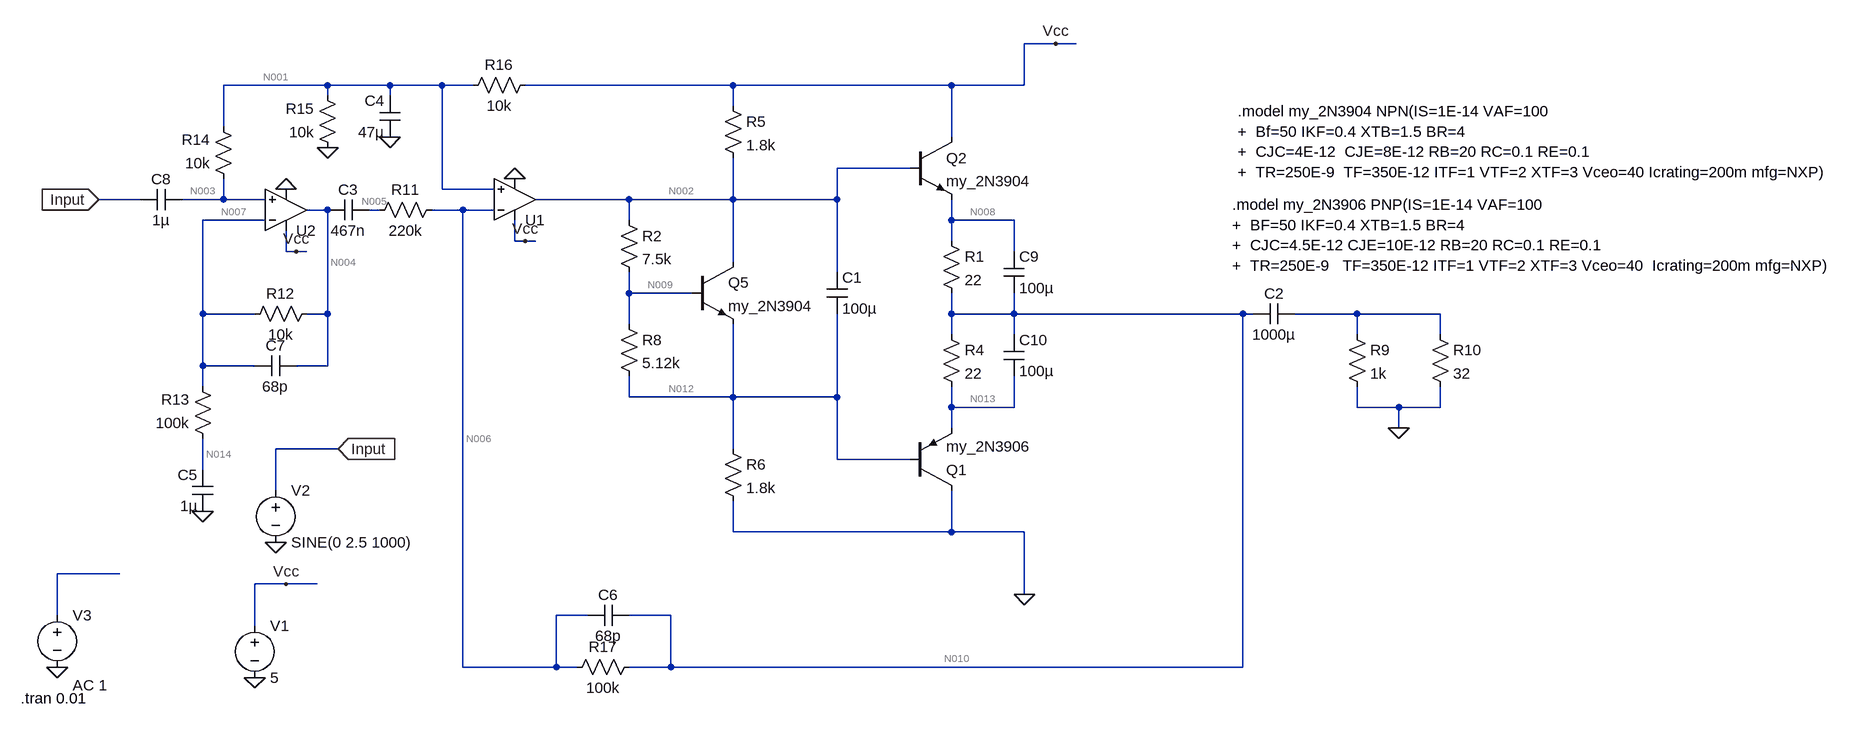
[diagram p0: schematic ECE421FinalProjectV2.asc]
ECE421FinalProjectV2.asc, the LTspice schematic file:
Version 4
SHEET 1 1656 692
WIRE 48 -336 0 -336
WIRE 80 -336 48 -336
WIRE -1072 -272 -1232 -272
WIRE -976 -272 -1072 -272
WIRE -896 -272 -976 -272
WIRE -848 -272 -896 -272
WIRE -448 -272 -768 -272
WIRE -112 -272 -448 -272
WIRE 0 -272 0 -336
WIRE 0 -272 -112 -272
WIRE -1072 -256 -1072 -272
WIRE -976 -256 -976 -272
WIRE -448 -240 -448 -272
WIRE -1232 -208 -1232 -272
WIRE -112 -192 -112 -272
WIRE -176 -144 -288 -144
WIRE -896 -112 -896 -272
WIRE -816 -112 -896 -112
WIRE -1360 -96 -1424 -96
WIRE -1232 -96 -1232 -128
WIRE -1232 -96 -1296 -96
WIRE -1168 -96 -1232 -96
WIRE -608 -96 -752 -96
WIRE -448 -96 -448 -160
WIRE -448 -96 -608 -96
WIRE -288 -96 -288 -144
WIRE -288 -96 -448 -96
WIRE -1072 -80 -1104 -80
WIRE -992 -80 -1008 -80
WIRE -864 -80 -912 -80
WIRE -816 -80 -864 -80
WIRE -1168 -64 -1264 -64
WIRE -608 -64 -608 -96
WIRE -112 -64 -112 -96
WIRE -16 -64 -112 -64
WIRE -784 -32 -784 -64
WIRE -768 -32 -784 -32
WIRE -752 -32 -768 -32
WIRE -112 -32 -112 -64
WIRE -1136 -16 -1136 -48
WIRE -1120 -16 -1136 -16
WIRE -1104 -16 -1120 -16
WIRE -16 -16 -16 -64
WIRE -448 0 -448 -96
WIRE -288 16 -288 -96
WIRE -608 48 -608 16
WIRE -512 48 -608 48
WIRE -1264 80 -1264 -64
WIRE -1184 80 -1264 80
WIRE -1072 80 -1072 -80
WIRE -1072 80 -1104 80
WIRE -112 80 -112 48
WIRE -16 80 -16 48
WIRE -16 80 -112 80
WIRE 336 80 -16 80
WIRE 352 80 336 80
WIRE 512 80 416 80
WIRE 640 80 512 80
WIRE -608 96 -608 48
WIRE -112 112 -112 80
WIRE -16 112 -16 80
WIRE 512 112 512 80
WIRE 640 112 640 80
WIRE -1264 160 -1264 80
WIRE -1184 160 -1264 160
WIRE -1072 160 -1072 80
WIRE -1072 160 -1120 160
WIRE -1264 192 -1264 160
WIRE -608 208 -608 176
WIRE -448 208 -448 96
WIRE -448 208 -608 208
WIRE -288 208 -288 80
WIRE -288 208 -448 208
WIRE -112 224 -112 192
WIRE -16 224 -16 176
WIRE -16 224 -112 224
WIRE 512 224 512 192
WIRE 576 224 512 224
WIRE 640 224 640 192
WIRE 640 224 576 224
WIRE -112 256 -112 224
WIRE 576 256 576 224
WIRE -1056 288 -1152 288
WIRE -448 288 -448 208
WIRE -288 304 -288 208
WIRE -176 304 -288 304
WIRE -1264 320 -1264 272
WIRE -1152 352 -1152 288
WIRE -448 416 -448 368
WIRE -112 416 -112 352
WIRE -112 416 -448 416
WIRE 0 416 -112 416
WIRE -1392 480 -1488 480
WIRE -1136 496 -1184 496
WIRE -1088 496 -1136 496
WIRE 0 512 0 416
WIRE -1488 544 -1488 480
WIRE -672 544 -720 544
WIRE -544 544 -608 544
WIRE -1184 560 -1184 496
WIRE -864 624 -864 -80
WIRE -720 624 -720 544
WIRE -720 624 -864 624
WIRE -688 624 -720 624
WIRE -544 624 -544 544
WIRE -544 624 -608 624
WIRE 336 624 336 80
WIRE 336 624 -544 624
FLAG -1184 640 0
FLAG 0 512 0
FLAG -1136 496 Vcc
FLAG 48 -336 Vcc
FLAG 576 256 0
FLAG -784 -128 0
FLAG -1136 -112 0
FLAG -768 -32 Vcc
FLAG -1120 -16 Vcc
FLAG -1424 -96 Input
IOPIN -1424 -96 In
FLAG -976 -192 0
FLAG -1072 -176 0
FLAG -1264 384 0
FLAG -1152 432 0
FLAG -1488 624 0
FLAG -1056 288 Input
IOPIN -1056 288 In
SYMBOL pnp -176 352 M180
SYMATTR InstName Q1
SYMATTR Value my_2N3906
SYMBOL npn -176 -192 R0
SYMATTR InstName Q2
SYMATTR Value my_2N3904
SYMBOL npn -512 0 R0
SYMATTR InstName Q5
SYMATTR Value my_2N3904
SYMBOL cap -304 16 R0
SYMATTR InstName C1
SYMATTR Value 100µ
SYMBOL cap 416 64 R90
WINDOW 0 0 32 VBottom 2
WINDOW 3 32 32 VTop 2
SYMATTR InstName C2
SYMATTR Value 1000µ
SYMBOL res -128 -48 R0
SYMATTR InstName R1
SYMATTR Value 22
SYMBOL res -128 96 R0
SYMATTR InstName R4
SYMATTR Value 22
SYMBOL res -464 -256 R0
SYMATTR InstName R5
SYMATTR Value 1.8k
SYMBOL res -464 272 R0
SYMATTR InstName R6
SYMATTR Value 1.8k
SYMBOL res -624 80 R0
SYMATTR InstName R8
SYMATTR Value 5.12k
SYMBOL res 496 96 R0
SYMATTR InstName R9
SYMATTR Value 1k
SYMBOL res 624 96 R0
SYMATTR InstName R10
SYMATTR Value 32
SYMBOL voltage -1184 544 R0
WINDOW 123 0 0 Left 0
WINDOW 39 0 0 Left 0
SYMATTR InstName V1
SYMATTR Value 5
SYMBOL Opamps\\UniversalOpamp2 -784 -96 M180
SYMATTR InstName U1
SYMBOL Opamps\\UniversalOpamp2 -1136 -80 M180
SYMATTR InstName U2
SYMBOL cap -1008 -96 R90
WINDOW 0 0 32 VBottom 2
WINDOW 3 32 32 VTop 2
SYMATTR InstName C3
SYMATTR Value 467n
SYMBOL cap -960 -192 R180
WINDOW 0 24 56 Left 2
WINDOW 3 24 8 Left 2
SYMATTR InstName C4
SYMATTR Value 47µ
SYMBOL cap -1248 384 R180
WINDOW 0 24 56 Left 2
WINDOW 3 24 8 Left 2
SYMATTR InstName C5
SYMATTR Value 1µ
SYMBOL cap -672 560 R270
WINDOW 0 32 32 VTop 2
WINDOW 3 0 32 VBottom 2
SYMATTR InstName C6
SYMATTR Value 68p
SYMBOL res -896 -96 R90
WINDOW 0 0 56 VBottom 2
WINDOW 3 32 56 VTop 2
SYMATTR InstName R11
SYMATTR Value 220k
SYMBOL res -1088 64 R90
WINDOW 0 0 56 VBottom 2
WINDOW 3 32 56 VTop 2
SYMATTR InstName R12
SYMATTR Value 10k
SYMBOL res -1248 288 R180
WINDOW 0 36 76 Left 2
WINDOW 3 36 40 Left 2
SYMATTR InstName R13
SYMATTR Value 100k
SYMBOL cap -1184 176 R270
WINDOW 0 32 32 VTop 2
WINDOW 3 0 32 VBottom 2
SYMATTR InstName C7
SYMATTR Value 68p
SYMBOL cap -1360 -80 R270
WINDOW 0 32 32 VTop 2
WINDOW 3 0 32 VBottom 2
SYMATTR InstName C8
SYMATTR Value 1µ
SYMBOL res -1216 -112 R180
WINDOW 0 36 76 Left 2
WINDOW 3 36 40 Left 2
SYMATTR InstName R14
SYMATTR Value 10k
SYMBOL res -1056 -160 R180
WINDOW 0 36 76 Left 2
WINDOW 3 36 40 Left 2
SYMATTR InstName R15
SYMATTR Value 10k
SYMBOL res -752 -288 R90
WINDOW 0 0 56 VBottom 2
WINDOW 3 32 56 VTop 2
SYMATTR InstName R16
SYMATTR Value 10k
SYMBOL res -592 608 R90
WINDOW 0 0 56 VBottom 2
WINDOW 3 32 56 VTop 2
SYMATTR InstName R17
SYMATTR Value 100k
SYMBOL voltage -1152 336 R0
WINDOW 123 0 0 Left 0
WINDOW 39 0 0 Left 0
SYMATTR InstName V2
SYMATTR Value SINE(0 2.5 1000)
SYMBOL res -624 -80 R0
SYMATTR InstName R2
SYMATTR Value 7.5k
SYMBOL cap -32 -16 R0
SYMATTR InstName C9
SYMATTR Value 100µ
SYMBOL cap -32 112 R0
SYMATTR InstName C10
SYMATTR Value 100µ
SYMBOL voltage -1488 528 R0
WINDOW 123 24 124 Left 2
WINDOW 39 0 0 Left 0
SYMATTR Value2 AC 1
SYMATTR InstName V3
SYMATTR Value ""
TEXT 328 -232 Left 2 !.model my_2N3904 NPN(IS=1E-14 VAF=100\n+  Bf=50 IKF=0.4 XTB=1.5 BR=4\n+  CJC=4E-12  CJE=8E-12 RB=20 RC=0.1 RE=0.1\n+  TR=250E-9  TF=350E-12 ITF=1 VTF=2 XTF=3 Vceo=40 Icrating=200m mfg=NXP)
TEXT 320 -88 Left 2 !.model my_2N3906 PNP(IS=1E-14 VAF=100\n+  BF=50 IKF=0.4 XTB=1.5 BR=4\n+  CJC=4.5E-12 CJE=10E-12 RB=20 RC=0.1 RE=0.1\n+  TR=250E-9   TF=350E-12 ITF=1 VTF=2 XTF=3 Vceo=40  Icrating=200m mfg=NXP)
TEXT -1544 672 Left 2 !.tran 0.01

The netlist it stands for:
* ECE421FinalProjectV2.asc
Q1 0 N012 N013 0 my_2N3906
Q2 Vcc N002 N008 0 my_2N3904
Q5 N002 N009 N012 0 my_2N3904
C1 N002 N012 100µ
C2 N011 N010 1000µ
R1 N008 N010 22
R4 N010 N013 22
R5 Vcc N002 1.8k
R6 N012 0 1.8k
R8 N009 N012 5.12k
R9 N011 0 1k
R10 N011 0 32
V1 Vcc 0 5
XU1 N001 N006 Vcc 0 N002 level.2 Avol=1Meg GBW=10Meg Slew=10Meg ilimit=25m rail=0 Vos=0 phimargin=45 en=0 enk=0 in=0 ink=0 Rin=500Meg  ; pins IN+ IN- V+ V- OUT
XU2 N003 N007 Vcc 0 N004 level.2 Avol=1Meg GBW=10Meg Slew=10Meg ilimit=25m rail=0 Vos=0 phimargin=45 en=0 enk=0 in=0 ink=0 Rin=500Meg  ; pins IN+ IN- V+ V- OUT
C3 N005 N004 467n
C4 0 N001 47µ
C5 0 N014 1µ
C6 N006 N010 68p
R11 N006 N005 220k
R12 N004 N007 10k
R13 N014 N007 100k
C7 N007 N004 68p
C8 Input N003 1µ
R14 N003 N001 10k
R15 0 N001 10k
R16 Vcc N001 10k
R17 N010 N006 100k
V2 Input 0 SINE(0 2.5 1000)
R2 N002 N009 7.5k
C9 N008 N010 100µ
C10 N010 N013 100µ
V3 N015 0 AC 1
.model NPN NPN
.model PNP PNP
.lib standard.bjt
.model my_2N3904 NPN(IS=1E-14 VAF=100
+  Bf=50 IKF=0.4 XTB=1.5 BR=4
+  CJC=4E-12  CJE=8E-12 RB=20 RC=0.1 RE=0.1
+  TR=250E-9  TF=350E-12 ITF=1 VTF=2 XTF=3 Vceo=40 Icrating=200m mfg=NXP)
.model my_2N3906 PNP(IS=1E-14 VAF=100
+  BF=50 IKF=0.4 XTB=1.5 BR=4
+  CJC=4.5E-12 CJE=10E-12 RB=20 RC=0.1 RE=0.1
+  TR=250E-9   TF=350E-12 ITF=1 VTF=2 XTF=3 Vceo=40  Icrating=200m mfg=NXP)
.tran 0.01
.lib UniversalOpamps2.sub
.backanno
.end

* Results of the author's LTspice run, read from the files saved beside the schematic
* Operating Point, zero values left out:
*   V(n012) = 1.657 V
*   V(n013) = 2.362 V
*   V(vcc) = 5 V
*   V(n002) = 3.343 V
*   V(n008) = 2.638 V
*   V(n009) = 2.301 V
*   V(n010) = 2.5 V
*   V(n006) = 2.5 V
*   V(n001) = 2.5 V
*   V(n004) = 2.5 V
*   V(n007) = 2.5 V
*   V(n003) = 2.5 V
*   V(n005) = 2.5 V
*   V(n014) = 2.5 V
*   Ic(Q5) = 658.7 µA
*   Ib(Q5) = 13.06 µA
*   Ie(Q5) = -671.8 µA
*   Ic(Q2) = 6.151 mA
*   Ib(Q2) = 122.8 µA
*   Ie(Q2) = -6.274 mA
*   Ic(Q1) = -6.151 mA
*   Ib(Q1) = -122.8 µA
*   Ie(Q1) = 6.274 mA
*   I(R2) = 138.9 µA
*   I(R16) = 250 µA
*   I(R15) = -250 µA
*   I(R8) = 125.9 µA
*   I(R6) = 920.5 µA
*   I(R5) = 920.5 µA
*   I(R4) = 6.274 mA
*   I(R1) = 6.274 mA
*   I(V1) = -7.807 mA
*   Ix(u1:3) = 235.4 µA
*   Ix(u1:4) = -235.4 µA
*   Ix(u1:5) = 948.6 pA
*   Ix(u2:3) = 250 µA
*   Ix(u2:4) = -250 µA
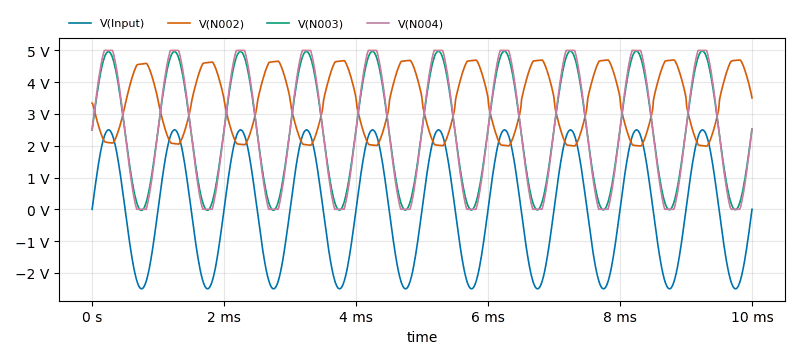
[diagram p1: Transient Analysis of ECE421FinalProjectV2.asc, plotted from the saved traces]
* Transient Analysis, 1 run:
*   V(Input): min -2.5 V, max 2.5 V, average -106.9 µV, rms 1.768 V, last 0 V
*   V(N002): min 1.987 V, max 4.698 V, average 3.354 V, rms 3.502 V, last 3.505 V
*   V(N003): min -34.14 mV, max 4.98 V, average 2.475 V, rms 3.04 V, last 2.525 V
*   V(N004): min 381.4 µV, max 5 V, average 2.48 V, rms 3.113 V, last 2.526 V